# Altium schematic sheet 电极转接板.SchDoc
size A4
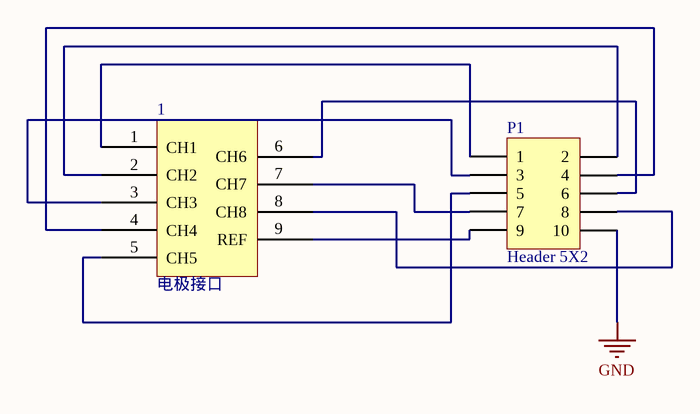
[diagram p0: 电极转接板.SchDoc]

## Parts
1  电极接口  [电极接口]
P1  Header 5X2  [牛角直插10P]

## Nets
GND: P1.10
Net1_1: 1.1(CH1) P1.1
Net1_2: 1.2(CH2) P1.2
Net1_3: 1.3(CH3) P1.3
Net1_4: 1.4(CH4) P1.4
Net1_5: 1.5(CH5) P1.5
Net1_6: 1.6(CH6) P1.6
Net1_7: 1.7(CH7) P1.7
Net1_8: 1.8(CH8) P1.8
Net1_9: 1.9(REF) P1.9

## Library data of the parts
P1 = Header 5X2: Header, 5-Pin, Dual row; LatestRevisionDate: 17-Jul-2002; LatestRevisionNote: Re-released for DXP Platform.; Publisher: Altium Limited